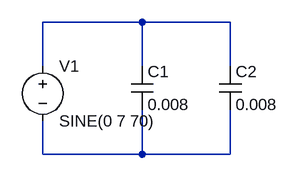
[diagram p0: schematic 2capparallel.asc]
2capparallel.asc, the LTspice schematic file:
Version 4
SHEET 1 880 680
WIRE 224 64 80 64
WIRE 352 64 224 64
WIRE 80 128 80 64
WIRE 224 128 224 64
WIRE 352 128 352 64
WIRE 80 256 80 208
WIRE 224 256 224 192
WIRE 224 256 80 256
WIRE 352 256 352 192
WIRE 352 256 224 256
SYMBOL voltage 80 112 R0
WINDOW 123 0 0 Left 0
WINDOW 39 0 0 Left 0
SYMATTR InstName V1
SYMATTR Value SINE(0 7 70)
SYMBOL cap 208 128 R0
SYMATTR InstName C1
SYMATTR Value 0.008
SYMBOL cap 336 128 R0
SYMATTR InstName C2
SYMATTR Value 0.008

The netlist it stands for:
* 2capparallel.asc
V1 N001 N002 SINE(0 7 70)
C1 N001 N002 0.008
C2 N001 N002 0.008
.backanno
.end